# EAGLE design ENGI301_clearasteroids (EAGLE 9.6.2)
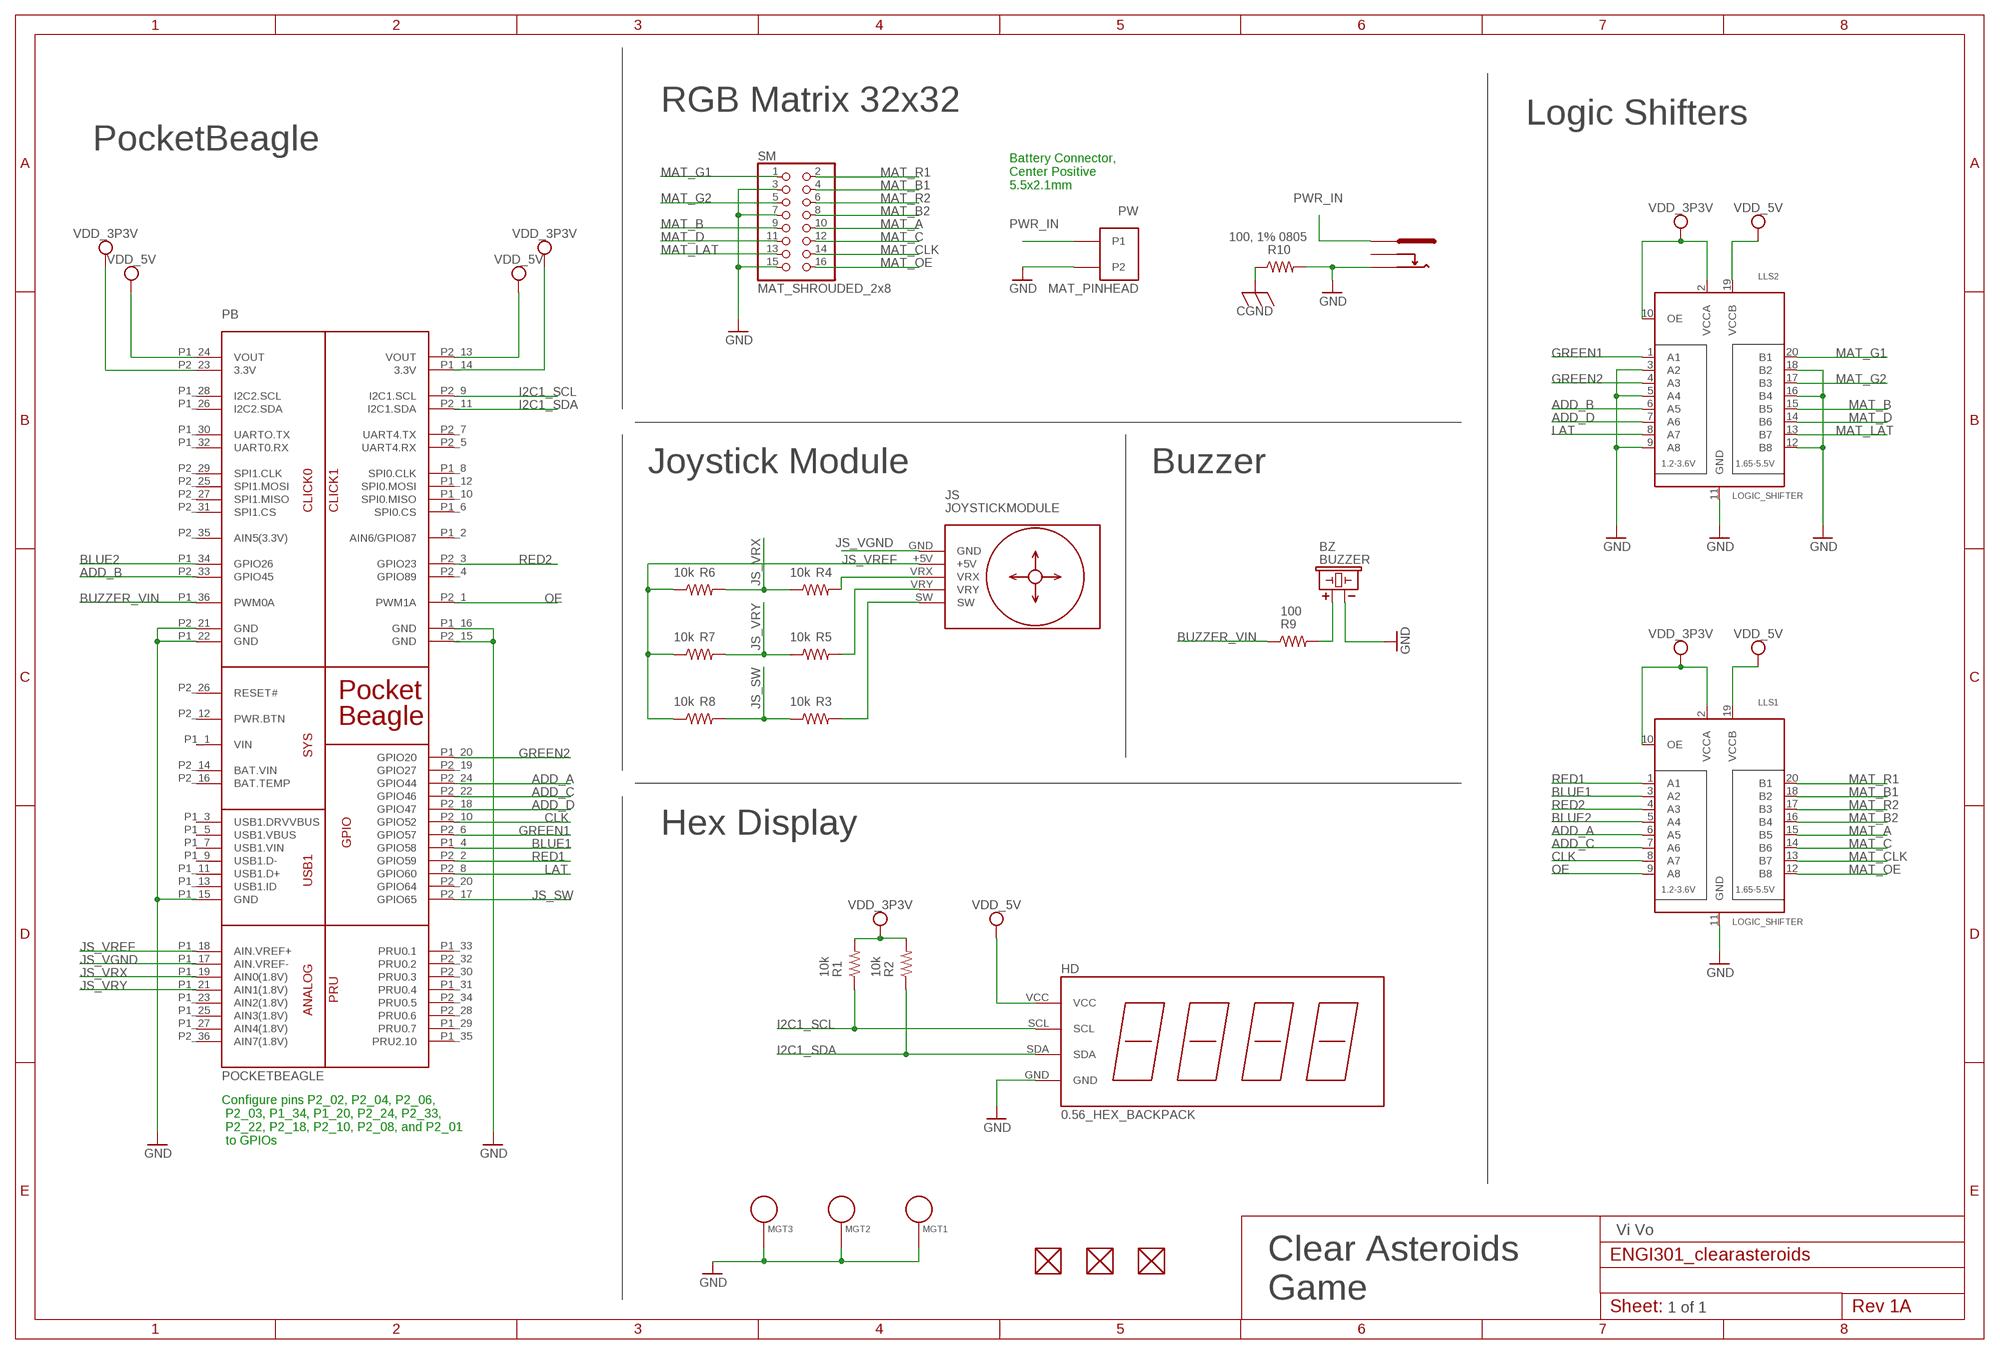
[diagram p0: schematic, sheet 1]

## Parts
BC  GHI_PJ-102B_POWER_CON  [GHI_PJ-102B_POWER_CON]
BZ  BUZZER  [BUZZER_6.5MM]
FUD1  FIDUCIAL  [FIDUCIAL_40MIL]
FUD2  FIDUCIAL  [FIDUCIAL_40MIL]
FUD3  FIDUCIAL  [FIDUCIAL_40MIL]
HD  0.56_HEX_BACKPACK  [0.56_HEX_BACKPACK]
JS  JOYSTICKMODULE  [JOYSTICK-MODULE]
LLS1  LOGIC_SHIFTER  TXB0108PWR  [TSSOP20]
LLS2  LOGIC_SHIFTER  TXB0108PWR  [TSSOP20]
MGT1  MOUNTING_HOLE  [MOUNTING_HOLE]
MGT2  MOUNTING_HOLE  [MOUNTING_HOLE]
MGT3  MOUNTING_HOLE  [MOUNTING_HOLE]
PB  POCKETBEAGLE  [POCKETBEAGLE]
PW  MAT_PINHEAD  [MSHIELD_TERMBLOCK508]
R1  10k  R_R1206  [R1206]
R2  10k  R_R1206  [R1206]
R3  10k  R_R1206  [R1206]
R4  10k  R_R1206  [R1206]
R5  10k  R_R1206  [R1206]
R6  10k  R_R1206  [R1206]
R7  10k  R_R1206  [R1206]
R8  10k  R_R1206  [R1206]
R9  100  R_R1206  [R1206]
R10  100, 1% 0805  R_R1206  [R1206]
SM  MAT_SHROUDED_2x8  MICROBUILDER_HEADER-2X8_SHROUDEDSMT  [MICROBUILDER_2X08_SHROUDEDSMT]

## Nets
ADD_A: LLS1.6(A5) PB.P2_24(GPIO44)
ADD_B: LLS2.6(A5) PB.P2_33(GPIO45)
ADD_C: LLS1.7(A6) PB.P2_22(GPIO46)
ADD_D: LLS2.7(A6) PB.P2_18(GPIO47)
BLUE1: LLS1.3(A2) PB.P1_4(GPIO58)
BLUE2: LLS1.5(A4) PB.P1_34(GPIO26)
BUZZER_VIN: PB.P1_36(PWM0A) R9.1
CGND: R10.1
CLK: LLS1.8(A7) PB.P2_10(GPIO52)
GND: BC.OUT BZ.- HD.GND LLS1.11(GND) LLS2.3(A2) LLS2.5(A4) LLS2.9(A8) LLS2.11(GND) LLS2.12(B8) LLS2.16(B4) LLS2.18(B2) MGT1.P$1 MGT2.P$1 MGT3.P$1 PB.P1_15(GND) PB.P1_16(GND) PB.P1_22(GND) PB.P2_15(GND) PB.P2_21(GND) PW.P$4(P2) R10.2 SM.3 SM.7 SM.15
GREEN1: LLS2.1(A1) PB.P2_6(GPIO57)
GREEN2: LLS2.4(A3) PB.P1_20(GPIO20)
I2C1_SCL: HD.SCL PB.P2_9(I2C1.SCL) R1.1
I2C1_SDA: HD.SDA PB.P2_11(I2C1.SDA) R2.1
JS_SW: PB.P2_17(GPIO65) R3.1 R8.2
JS_VGND: JS.GND PB.P1_17(AIN.VREF-)
JS_VREF: JS.+5V PB.P1_18(AIN.VREF+) R6.1 R7.1 R8.1
JS_VRX: PB.P1_19(AIN0(1.8V)) R4.1 R6.2
JS_VRY: PB.P1_21(AIN1(1.8V)) R5.1 R7.2
LAT: LLS2.8(A7) PB.P2_8(GPIO60)
MAT_A: LLS1.15(B5) SM.10
MAT_B: LLS2.15(B5) SM.9
MAT_B1: LLS1.18(B2) SM.4
MAT_B2: LLS1.16(B4) SM.8
MAT_C: LLS1.14(B6) SM.12
MAT_CLK: LLS1.13(B7) SM.14
MAT_D: LLS2.14(B6) SM.11
MAT_G1: LLS2.20(B1) SM.1
MAT_G2: LLS2.17(B3) SM.5
MAT_LAT: LLS2.13(B7) SM.13
MAT_OE: LLS1.12(B8) SM.16
MAT_R1: LLS1.20(B1) SM.2
MAT_R2: LLS1.17(B3) SM.6
N$46: BZ.+ R9.2
N$48: JS.VRX R4.2
N$49: JS.VRY R5.2
N$50: JS.SW R3.2
OE: LLS1.9(A8) PB.P2_1(PWM1A)
PWR_IN: BC.IN PW.P$3(P1)
RED1: LLS1.1(A1) PB.P2_2(GPIO59)
RED2: LLS1.4(A3) PB.P2_3(GPIO23)
VDD_3P3V: LLS1.2(VCCA) LLS1.10(OE) LLS2.2(VCCA) LLS2.10(OE) PB.P1_14(3.3V) PB.P2_23(3.3V) R1.2 R2.2
VDD_5V: HD.VCC LLS1.19(VCCB) LLS2.19(VCCB) PB.P1_24(VOUT) PB.P2_13(VOUT)
Unconnected: BC.OUT_CON FUD1.P$1 FUD2.P$1 FUD3.P$1 PB.P1_1(VIN) PB.P1_2(AIN6/GPIO87) PB.P1_3(USB1.DRVVBUS) PB.P1_5(USB1.VBUS) PB.P1_6(SPI0.CS) PB.P1_7(USB1.VIN) PB.P1_8(SPI0.CLK) PB.P1_9(USB1.D-) PB.P1_10(SPI0.MISO) PB.P1_11(USB1.D+) PB.P1_12(SPI0.MOSI) PB.P1_13(USB1.ID) PB.P1_23(AIN2(1.8V)) PB.P1_25(AIN3(1.8V)) PB.P1_26(I2C2.SDA) PB.P1_27(AIN4(1.8V)) PB.P1_28(I2C2.SCL) PB.P1_29(PRU0.7) PB.P1_30(UARTO.TX) PB.P1_31(PRU0.4) PB.P1_32(UART0.RX) PB.P1_33(PRU0.1) PB.P1_35(PRU2.10) PB.P2_4(GPIO89) PB.P2_5(UART4.RX) PB.P2_7(UART4.TX) PB.P2_12(PWR.BTN) PB.P2_14(BAT.VIN) PB.P2_16(BAT.TEMP) PB.P2_19(GPIO27) PB.P2_20(GPIO64) PB.P2_25(SPI1.MOSI) PB.P2_26(RESET#) PB.P2_27(SPI1.MISO) PB.P2_28(PRU0.6) PB.P2_29(SPI1.CLK) PB.P2_30(PRU0.3) PB.P2_31(SPI1.CS) PB.P2_32(PRU0.2) PB.P2_34(PRU0.5) PB.P2_35(AIN5(3.3V)) PB.P2_36(AIN7(1.8V))

## Notes on the sheet
- RGB Matrix 32x32
- Logic Shifters
- PocketBeagle
- Battery Connector, 
  Center Positive
  5.5x2.1mm
- Joystick Module | Buzzer
- Hex Display
- Configure pins P2_02, P2_04, P2_06,
   P2_03, P1_34, P1_20, P2_24, P2_33,
   P2_22, P2_18, P2_10, P2_08, and P2_01
   to GPIOs
- Vi Vo
- Clear Asteroids 
  Game
- 1 of 1

## Library data of the parts
BC = BeagleBone_Blue:GHI_PJ-102B_POWER_CON
BZ = ENGI301_ClassParts:BUZZER: CEM-1203 Buzzer
FUD1-FUD3 = ENGI301_Parts:FIDUCIAL
HD = ENGI301_ClassParts:0.56_HEX_BACKPACK: 0.56" LED HEX Backback - Adafruit HT16K33 - https://www.adafruit.com/product/878 - https://www.adafruit.com/product/879 - https://www.adafruit.com/product/880 - https://www.adafruit.com/product/881 - https://www.adafruit.com/product/1002
JS = ENGI301_AddParts:JOYSTICKMODULE: Joystick Module with Switch Button
LLS1 LLS2 = Adafruit TXB0108:TXB0108PWR: 8-Bit Bi-Directional Level Shifter 1.2V-3.6V (VCCA) to 1.65V-5.5V (VCCB) bi-directional level shifter with auto direction sensing. Max data rate - VCCA 1.8V: 20Mbps (50ns), VCCA 3.3V: 100Mbps (10ns) Digikey: 296-21527-1-ND
MGT1-MGT3 = ENGI301_ClassParts:MOUNTING_HOLE: Chassis Mounting Hole w/GND connection ability
PB = ENGI301_AddParts:POCKETBEAGLE
PW = Adafruit RGB Matrix Shield:MAT_PINHEAD
R1 R2 R9 R10 = ENGI301_ClassParts:R_: RESISTOR, American symbol
R3 = ENGI301_ClassParts:R_: RESISTOR, American symbol; R3: 10k
R4 = ENGI301_ClassParts:R_: RESISTOR, American symbol; R4: 10k
R5 = ENGI301_ClassParts:R_: RESISTOR, American symbol; R5: 10k
R6 = ENGI301_ClassParts:R_: RESISTOR, American symbol; R6: 10k
R7 = ENGI301_ClassParts:R_: RESISTOR, American symbol; R7: 10k
R8 = ENGI301_ClassParts:R_: RESISTOR, American symbol; R8: 10k
SM = Adafruit RGB Matrix Shield:MICROBUILDER_HEADER-2X8

## Board
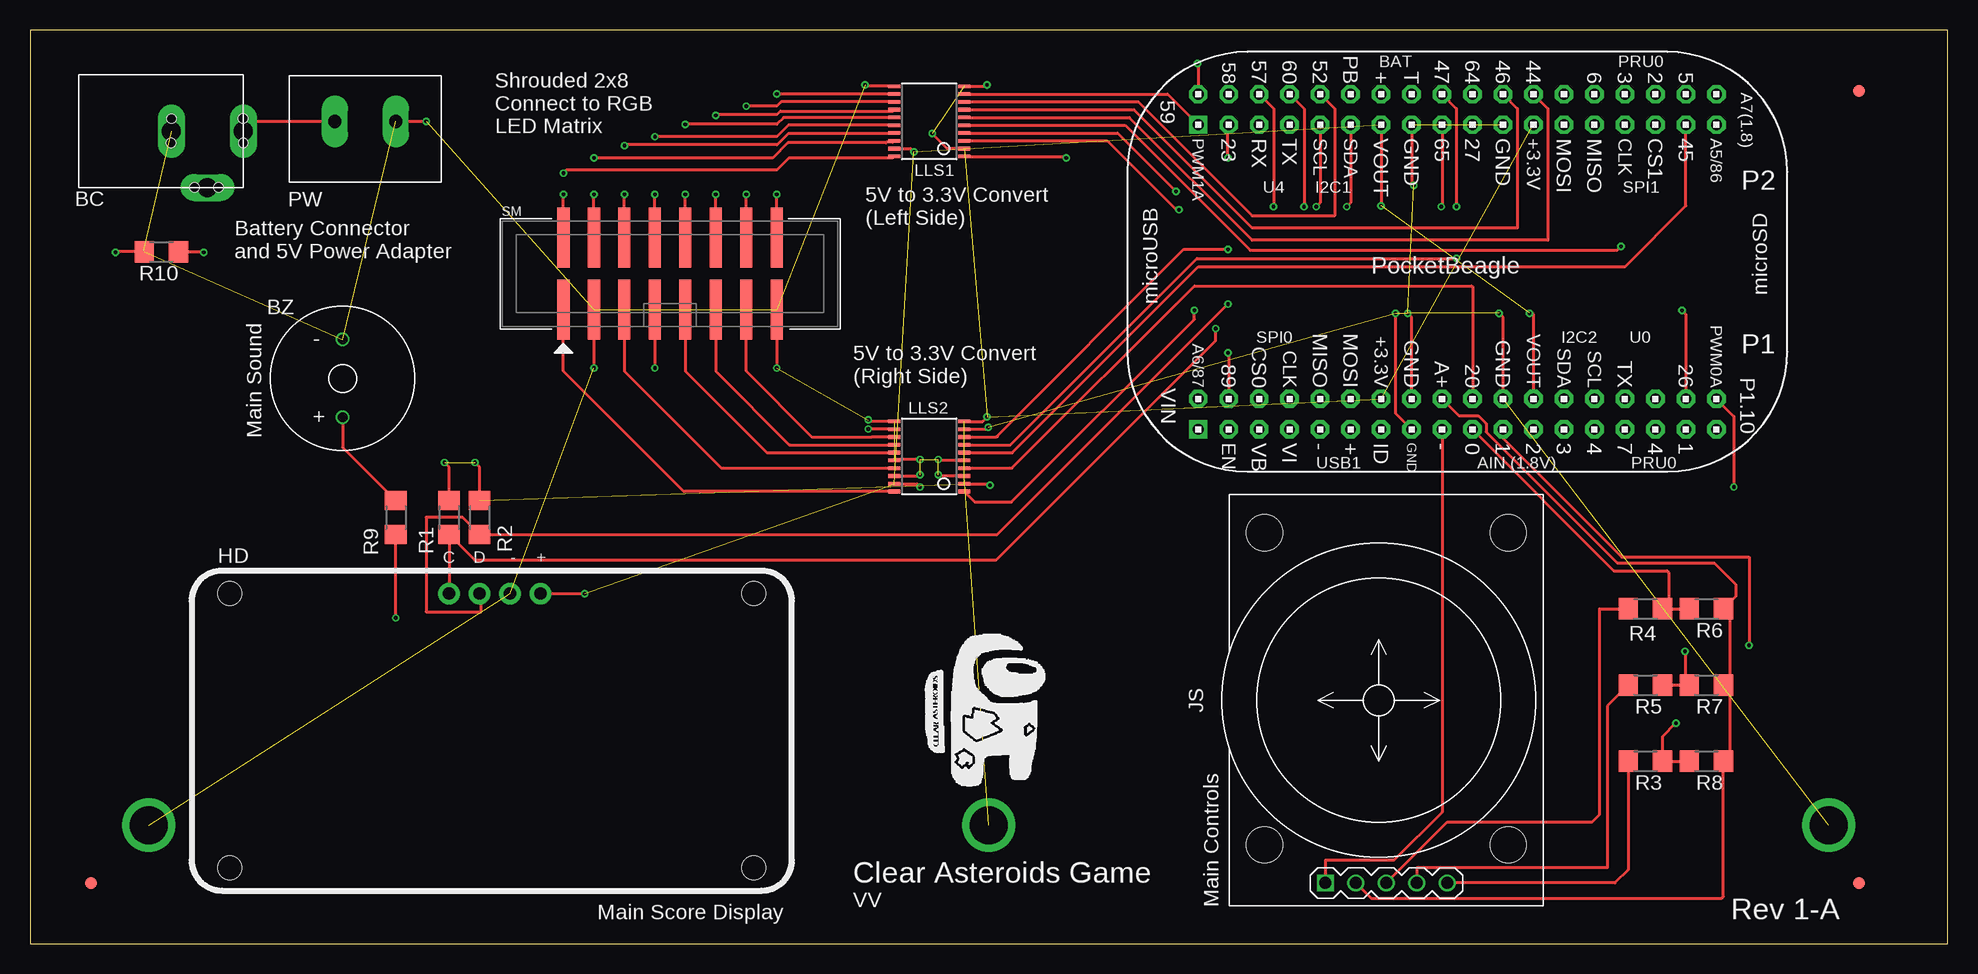
[diagram p1: board, top side]
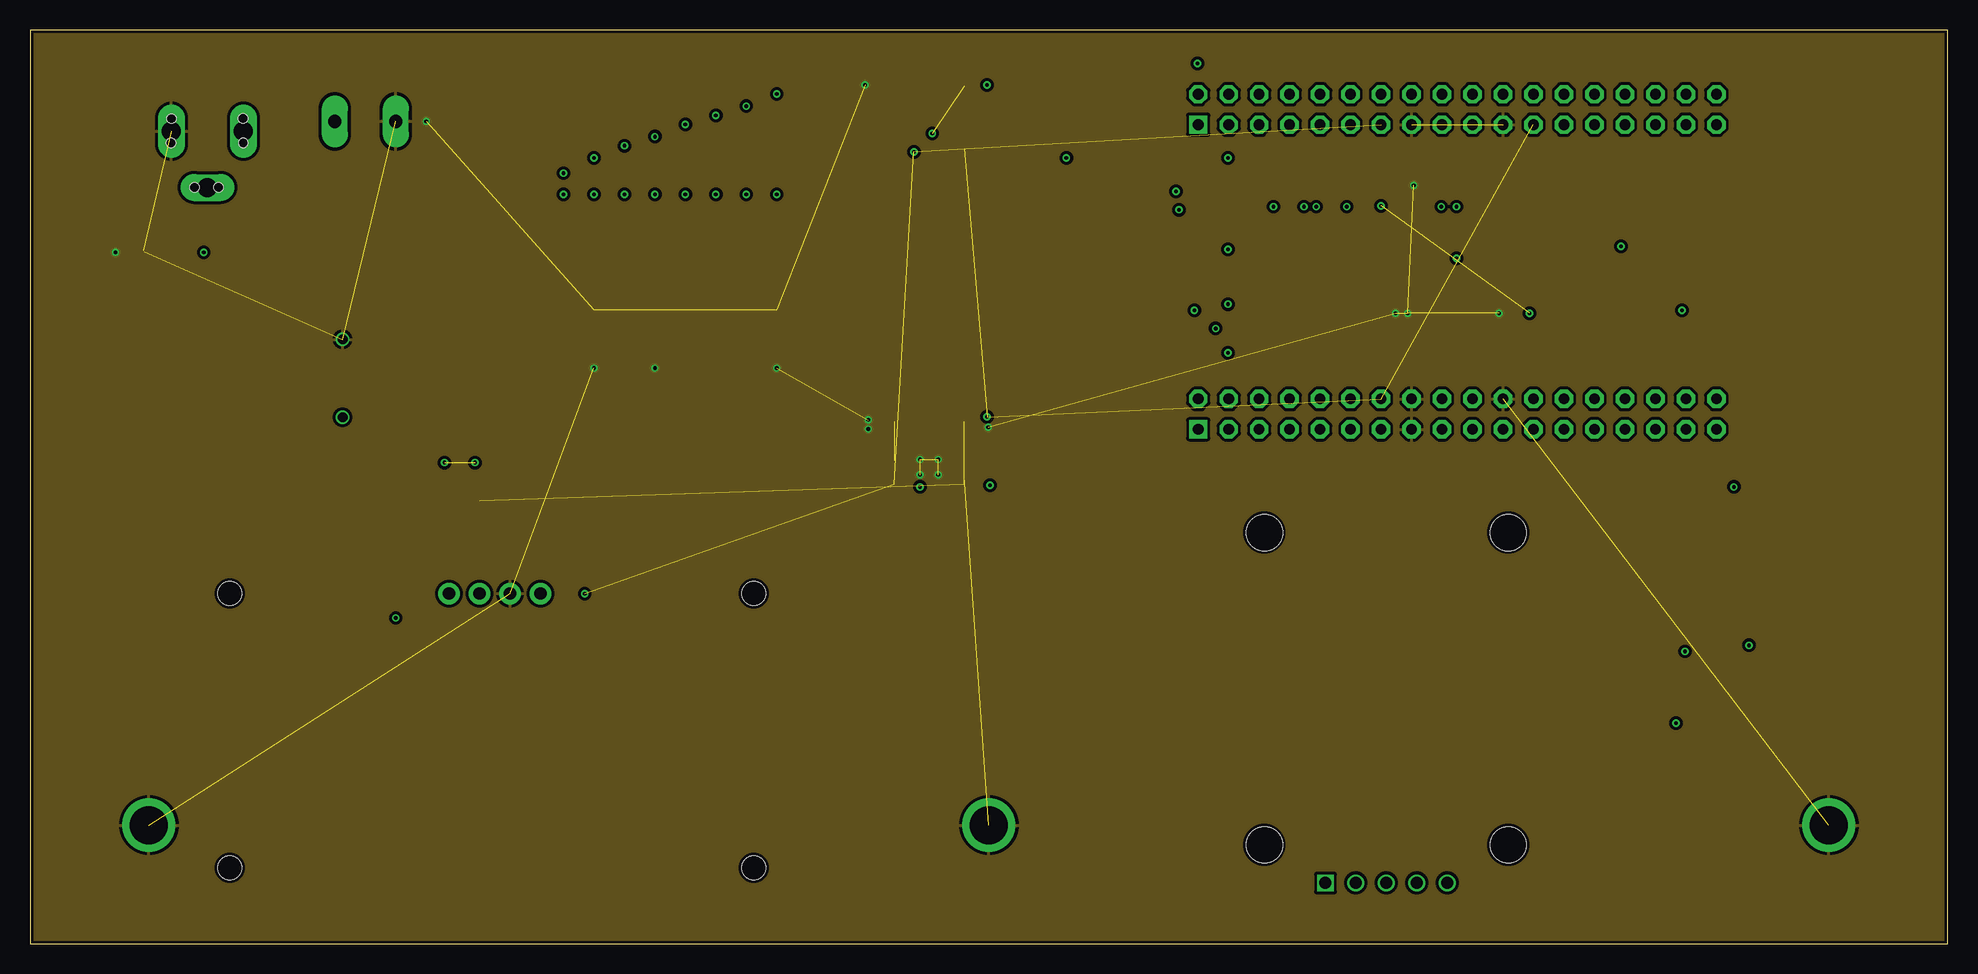
[diagram p2: board, inner layer Route2]
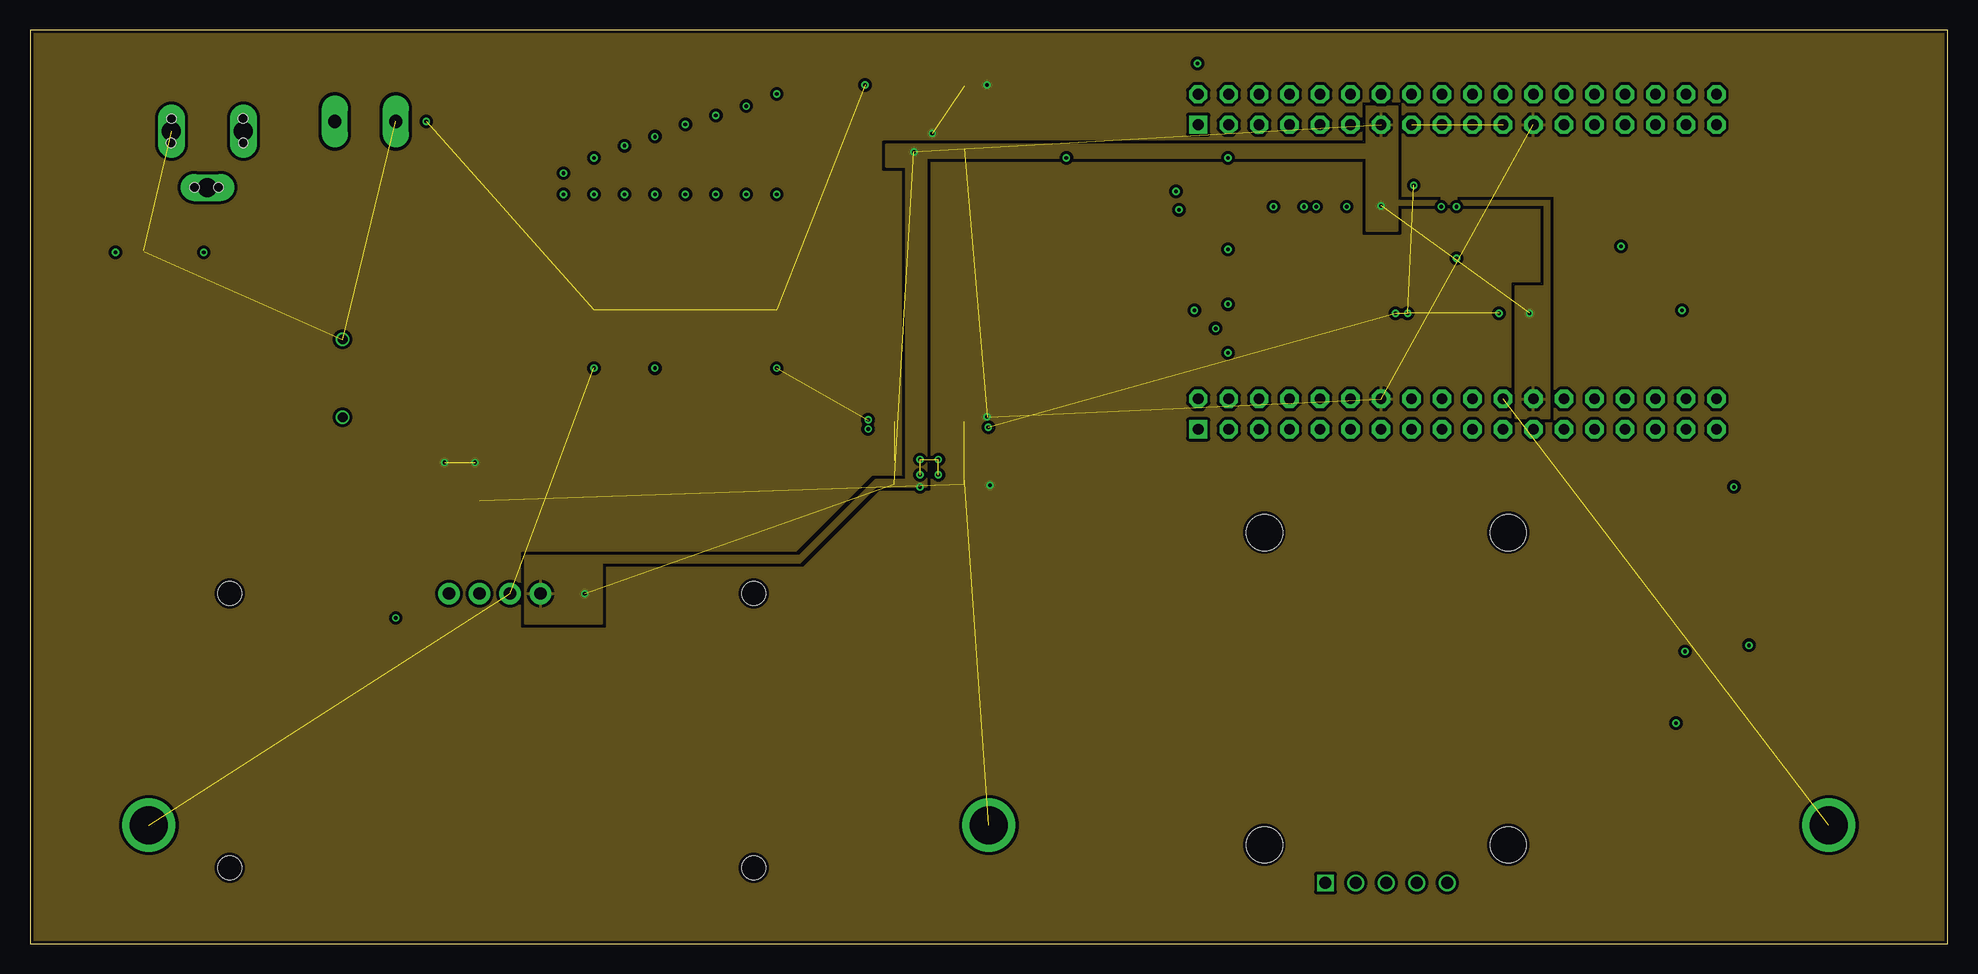
[diagram p3: board, inner layer Route15]
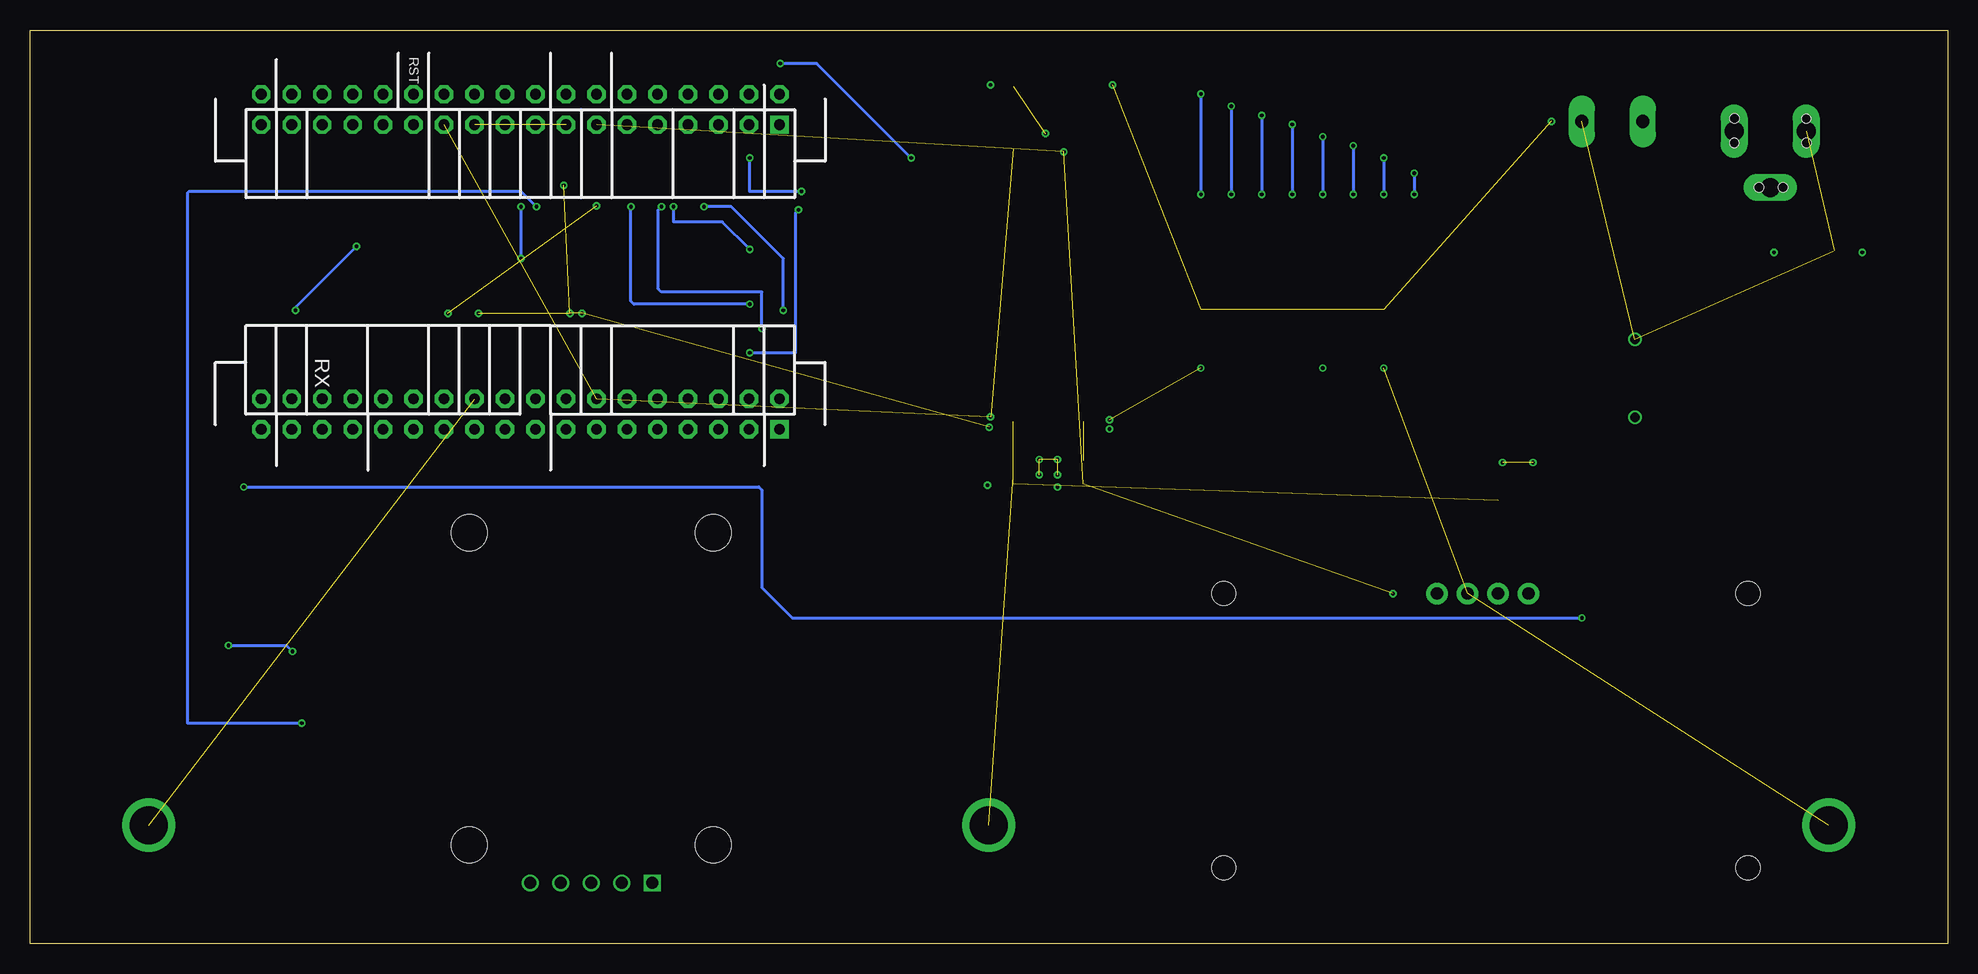
[diagram p4: board, bottom side, seen from below]

Size 159.8 x 76.2 mm. Coordinates in mm from the lower left corner, seen from the top.
Outline: 0,0 159.8,0 159.8,76.2 0,76.2 0,0
Copper layers (1*2*15*16): Top 0.035mm / dielectric 0.23mm / Route2 0.035mm / dielectric 0.93mm / Route15 0.035mm / dielectric 0.23mm / Bottom 0.035mm
Design rules "ENGI301_4lyr": minimum track width 10mil, minimum drill 12mil, track to track 10mil, track to pad 10mil, pad to pad 10mil, via to via 10mil, smd to smd 10mil, copper to edge 10mil, drill to drill 12mil, minimum pad ring 6mil, minimum via ring 6mil, stop-mask expansion 3mil, vias tented up to drill 25mil, thermal gap 10mil

### Footprints (pad centres in the part's own frame; a part is rotated, then mirrored left to right if it is on the bottom)
GHI_PJ-102B_POWER_CON = drill 1.6 long: IN -6,0; OUT 0,0; OUT_CON -3,4.7 | hole 0.762: 0,-1.041; 0.025,0.965; -5.994,0.965; -5.969,-1.067; -1.93,4.674; -3.937,4.674
BUZZER_6.5MM = drill 0.8: + 0,-3.25; - 0,3.25
FIDUCIAL_40MIL = smd 1.016 x 1.016: P$1 0,0
0.56_HEX_BACKPACK = drill 1.016 pad 1.778: GND 1.524,11.43; SCL -3.556,11.43; SDA -1.016,11.43; VCC 4.064,11.43 | hole 2: -21.844,-11.43; 21.844,-11.43; -21.844,11.43; 21.844,11.43
JOYSTICK-MODULE = drill 1: +5V -15.24,1.27; SW -15.24,-6.35; VRX -15.24,-1.27; VRY -15.24,-3.81 | drill 1 square: GND -15.24,3.81 | hole 3: -12.065,8.89; -12.065,-11.43; 13.97,-11.43; 13.97,8.89
TSSOP20 = smd 0.305 x 0.991: 1 -2.925,-2.918; 2 -2.275,-2.918; 3 -1.625,-2.918; 4 -0.975,-2.918; 5 -0.325,-2.918; 6 0.325,-2.918; 7 0.975,-2.918; 8 1.625,-2.918; 9 2.275,-2.918; 10 2.925,-2.918; 11 2.925,2.918; 12 2.275,2.918; 13 1.625,2.918; 14 0.975,2.918; 15 0.325,2.918; 16 -0.325,2.918; 17 -0.975,2.918; 18 -1.625,2.918; 19 -2.275,2.918; 20 -2.925,2.918
MOUNTING_HOLE = drill 3.175 pad 4.445: P$1 0,0
POCKETBEAGLE = drill 0.889 pad 1.524 square: P1_1 5.91,3.53; P2_1 5.91,28.93 | drill 0.889 pad 1.524 octagon: P1_2 5.91,6.07; P1_3 8.45,3.53; P1_4 8.45,6.07; P1_5 10.99,3.53; P1_6 10.99,6.07; P1_7 13.53,3.53; P1_8 13.53,6.07; P1_9 16.07,3.53; P1_10 16.07,6.07; P1_11 18.61,3.53; P1_12 18.61,6.07; P1_13 21.15,3.53; P1_14 21.15,6.07; P1_15 23.69,3.53; P1_16 23.69,6.07; P1_17 26.23,3.53; P1_18 26.23,6.07; P1_19 28.77,3.53; P1_20 28.77,6.07; P1_21 31.31,3.53; P1_22 31.31,6.07; P1_23 33.85,3.53; P1_24 33.85,6.07; P1_25 36.39,3.53; P1_26 36.39,6.07; P1_27 38.93,3.53; P1_28 38.93,6.07; P1_29 41.47,3.53; P1_30 41.47,6.07; P1_31 44.01,3.53; P1_32 44.01,6.07; P1_33 46.55,3.53; P1_34 46.55,6.07; P1_35 49.09,3.53; P1_36 49.09,6.07; P2_2 5.91,31.47; P2_3 8.45,28.93; P2_4 8.45,31.47; P2_5 10.99,28.93; P2_6 10.99,31.47; P2_7 13.53,28.93; P2_8 13.53,31.47; P2_9 16.07,28.93; P2_10 16.07,31.47; P2_11 18.61,28.93; P2_12 18.61,31.47; P2_13 21.15,28.93; P2_14 21.15,31.47; P2_15 23.69,28.93; P2_16 23.69,31.47; P2_17 26.23,28.93; P2_18 26.23,31.47; P2_19 28.77,28.93; P2_20 28.77,31.47; P2_21 31.31,28.93; P2_22 31.31,31.47; P2_23 33.85,28.93; P2_24 33.85,31.47; P2_25 36.39,28.93; P2_26 36.39,31.47; P2_27 38.93,28.93; P2_28 38.93,31.47; P2_29 41.47,28.93; P2_30 41.47,31.47; P2_31 44.01,28.93; P2_32 44.01,31.47; P2_33 46.55,28.93; P2_34 46.55,31.47; P2_35 49.09,28.93; P2_36 49.09,31.47
MSHIELD_TERMBLOCK508 = drill 1.1 pad 2.184 long: P$3 -2.54,0; P$4 2.54,0
R1206 = smd 1.6 x 1.803: 1 -1.422,0; 2 1.422,0
MICROBUILDER_2X08_SHROUDEDSMT = smd 1.02 x 5: 1 -8.89,-3; 2 -8.89,3; 3 -6.35,-3; 4 -6.35,3; 5 -3.81,-3; 6 -3.81,3; 7 -1.27,-3; 8 -1.27,3; 9 1.27,-3; 10 1.27,3; 11 3.81,-3; 12 3.81,3; 13 6.35,-3; 14 6.35,3; 15 8.89,-3; 16 8.89,3

### Placement (x,y rotation side)
BC  11.78,67.76 180 top
BZ  26.06,47.15 0 top
FUD1  5.08,5.08 0 top
FUD2  152.4,5.08 0 top
FUD3  152.4,71.12 0 top
HD  38.48,17.78 0 top
JS  111.76,20.32 90 top
LLS1  74.93,68.58 90 top
LLS2  74.93,40.64 90 top
MGT1  149.9,9.9 0 top
MGT2  9.9,9.9 0 top
MGT3  79.9,9.9 0 top
PB  91.44,39.37 0 top
PW  27.94,68.58 0 top
R1  34.92,35.56 90 top
R2  37.47,35.56 90 top
R3  134.62,15.24 180 top
R4  134.62,27.94 180 top
R5  134.62,21.59 180 top
R6  139.7,27.94 180 top
R7  139.7,21.59 180 top
R8  139.7,15.24 180 top
R9  30.48,35.56 90 top
R10  10.95,57.71 180 top
SM  53.34,55.88 0 top

### Tracks (layer width: path | path; a pad name or v marks a point on that pad's centre or on a via)
ADD_A
  Top 0.254: PB.P2_24 126.49,69.64 126.49,58.67 101.85,58.67 91.62,68.91 LLS1.6
ADD_B
  Top 0.254: PB.P2_33 137.99,61.54 132.92,56.46 97.36,56.46 81.86,40.97 LLS2.6
ADD_C
  Top 0.254: PB.P2_22 123.95,69.64 123.95,59.69 101.85,59.69 91.99,69.56 LLS1.7
ADD_D  (via drill 0.3)
  Top 0.254: PB.P2_18 118.87,69.64 v118.87,61.47 | v118.87,57.15 97.24,57.15 81.7,41.62 LLS2.7
  Bottom 0.254: v118.87,57.15 v118.87,61.47
BLUE1  (via drill 0.3)
  Top 0.254: LLS1.3 89.76,66.95 95.5,61.21 v95.76,61.21 | v99.82,49.28 99.89,49.21 PB.P1_4
  Bottom 0.254: v95.76,61.21 96.01,60.96 96.01,49.28 v99.82,49.28
BLUE2  (via drill 0.3)
  Top 0.254: LLS1.5 91.26,68.25 101.68,57.84 132.26,57.84 v132.59,58.17 | v137.67,52.83 137.99,52.51 PB.P1_34
  Bottom 0.254: v132.59,58.17 137.67,53.09 v137.67,52.83
BUZZER_VIN  (via drill 0.3)
  Top 0.254: PB.P1_36 141.99,43.98 v141.99,38.1 | v30.48,27.18 R9.1
  Bottom 0.254: v141.99,38.1 99.06,38.1 98.81,37.85 98.81,29.72 96.27,27.18 v30.48,27.18
CGND  (via drill 0.3)
  Top 0.254: R10.1 14.43,57.71 v14.48,57.66
CLK
  Top 0.254: LLS1.8 92.36,70.2 101.85,60.71 108.71,60.71 108.71,69.64 PB.P2_10
GND  (via drill 0.3)  (23 unrouted)
  Top 0.254: 9.45,57.78 R10.2 7.16,57.71 v7.11,57.66 | PB.P2_15 115.13,63.43 v115.32,63.25 | PB.P1_22 122.75,52.26 v122.43,52.58 | PB.P1_16 115.13,52.26 v114.81,52.58 | PB.P1_15 113.79,44.24 v113.79,52.58 | LLS2.9 79.7,42.91 v79.86,43.08 | LLS2.11 69.97,43.56 v69.85,43.69 | LLS2.12 69.86,42.91 v69.85,42.93 | v74.17,40.39 72.08,40.39 LLS2.16 | LLS2.18 74.07,39.02 v74.17,39.12 | LLS1.11 69.72,71.5 v69.6,71.63 | SM.3 v46.99,48.01 | SM.7 v52.07,48.01 | SM.15 v62.23,48.01 | PW.P$4 v33.02,68.58 | LLS2.5 75.76,40.31 v75.69,40.39 | LLS2.3 75.69,39.02 v75.69,39.12
  pour Route2: -2.54,78.74 162.56,78.74 162.56,-2.54 -2.54,-2.54
GREEN1  (via drill 0.3)
  Top 0.254: PB.P2_6 103.63,69.64 v103.63,61.47 | LLS2.1 78.73,36.83 81.79,36.83 97.03,52.07 v97.03,52.83
  Bottom 0.254: v97.03,52.83 97.03,57.15 101.35,61.47 v103.63,61.47
GREEN2
  Top 0.254: LLS2.4 81.83,39.66 97.03,54.86 120.14,54.86 120.21,54.8 PB.P1_20
I2C1_SCL  (via drill 0.3)
  Top 0.254: HD.SCL R1.1 37.06,32 80.52,32 98.81,50.29 v98.81,51.31 | PB.P2_9 107.51,61.79 v107.19,61.47
  Bottom 0.254: v98.81,51.31 98.81,54.36 107.19,54.36 107.44,54.61 107.44,61.21 v107.19,61.47
I2C1_SDA  (via drill 0.3)
  Top 0.254: PB.P2_11 110.05,61.79 v109.73,61.47 | v99.82,53.34 80.62,34.14 R2.1 36.04,35.56 33.02,35.56 33.02,27.69 37.59,27.69 37.59,29.08 HD.SDA
  Bottom 0.254: v99.82,53.34 109.47,53.34 109.73,53.59 v109.73,61.47
JS_SW  (via drill 0.3)
  Top 0.254: R8.2 R3.1 136.04,17.3 v137.16,18.41 | PB.P2_17 117.67,61.54 v117.6,61.47
  Bottom 0.254: v137.16,18.41 146.69,18.41 146.69,62.61 146.56,62.74 118.87,62.74 v117.6,61.47
JS_VGND
  Top 0.254: PB.P1_17 117.67,10.99 113.67,6.99 107.95,6.99 JS.GND
JS_VREF
  Top 0.254: JS.+5V 111.76,3.81 140.97,3.81 141.12,3.96 R8.1 141.63,15.75 141.63,21.08 R7.1 141.63,22.1 141.63,27.43 R6.1 142.14,28.96 142.14,29.97 140.36,31.75 132.28,31.75 121.35,42.68 121.35,43.37 120.68,44.04 119.07,44.04 PB.P1_18
JS_VRX
  Top 0.254: PB.P1_19 132,31.11 136.4,31.11 136.55,30.96 136.55,28.45 R4.1 R6.2
JS_VRY  (via drill 0.3)
  Top 0.254: R5.1 R7.2 137.92,21.95 v137.92,24.38 | PB.P1_21 122.75,42.14 132.63,32.26 143.26,32.26 v143.26,24.89
  Bottom 0.254: v143.26,24.89 138.43,24.89 v137.92,24.38
LAT  (via drill 0.3)
  Top 0.254: PB.P2_8 106.17,69.64 v106.17,61.47 | LLS2.8 80.52,42.27 | 80.62,42.27 80.52,42.27 | 80.52,42.27 96.17,57.91 v99.82,57.91
  Bottom 0.254: v99.82,57.91 102.11,60.2 106.17,60.2 v106.17,61.47
MAT_A  (via drill 0.3)
  Top 0.254: SM.10 v54.61,62.48 | LLS1.15 62.81,68.91 62.23,68.33 v54.61,68.33
  Bottom 0.254: v54.61,68.33 v54.61,62.48
MAT_B
  Top 0.254: SM.9 54.61,47.75 61.4,40.97 LLS2.15
MAT_B1  (via drill 0.3)
  Top 0.254: SM.4 v46.99,62.48 | LLS1.18 71.9,66.84 71.36,66.84 71.32,66.8 63.16,66.8 61.89,65.53 v46.99,65.53
  Bottom 0.254: v46.99,65.53 v46.99,62.48
MAT_B2  (via drill 0.3)
  Top 0.254: SM.8 v52.07,62.48 | LLS1.16 63.17,68.25 62.23,67.31 v52.07,67.31
  Bottom 0.254: v52.07,67.31 v52.07,62.48
MAT_C  (via drill 0.3)
  Top 0.254: SM.12 v57.15,62.48 | LLS1.14 71.9,69.44 62.54,69.44 62.26,69.16 57.23,69.16 v57.15,69.09
  Bottom 0.254: v57.15,69.09 v57.15,62.48
MAT_CLK  (via drill 0.3)
  Top 0.254: SM.14 v59.69,62.48 | LLS1.13 62.59,70.2 62.23,69.85 v59.69,69.85
  Bottom 0.254: v59.69,69.85 v59.69,62.48
MAT_D
  Top 0.254: SM.11 57.15,47.75 63.29,41.62 LLS2.14
MAT_G1
  Top 0.254: LLS2.20 54.49,37.72 44.45,47.75 SM.1
MAT_G2
  Top 0.254: SM.5 49.53,47.75 57.62,39.66 LLS2.17
MAT_LAT
  Top 0.254: LLS2.13 70.16,42.27 70.13,42.24 65.2,42.24 59.69,47.75 SM.13
MAT_OE  (via drill 0.3)
  Top 0.254: SM.16 v62.23,62.48 | LLS1.12 62.24,70.86 v62.23,70.87
  Bottom 0.254: v62.23,70.87 v62.23,62.48
MAT_R1  (via drill 0.3)
  Top 0.254: SM.2 v44.45,62.48 | v44.45,64.26 44.7,64.52 62.23,64.52 63.25,65.53 71.89,65.53 LLS1.20
  Bottom 0.254: v44.45,64.26 v44.45,62.48
MAT_R2  (via drill 0.3)
  Top 0.254: SM.6 v49.53,62.48 | LLS1.17 71.97,67.56 63.2,67.56 62.26,66.62 49.61,66.62 v49.53,66.55
  Bottom 0.254: v49.53,66.55 v49.53,62.48
N$46
  Top 0.254: BZ.+ 26.06,41.4 R9.2
N$48
  Top 0.254: JS.VRX 118.11,10.16 130.18,10.16 130.81,10.79 130.81,27.94 R4.2
N$49
  Top 0.254: R5.2 131.44,19.84 131.44,6.35 115.57,6.35 JS.VRY
N$50
  Top 0.254: R3.2 133.2,6.2 132.08,5.08 JS.SW
OE
  Top 0.254: LLS1.9 94.8,70.86 PB.P2_1
PWR_IN
  Top 0.254: BC.IN 18.6,68.58 PW.P$3
RED1  (via drill 0.3)
  Top 0.254: LLS1.1 86.24,65.66 v86.36,65.53 | v97.28,73.41 97.35,73.34 PB.P2_2
  Bottom 0.254: v86.36,65.53 94.23,73.41 v97.28,73.41
RED2  (via drill 0.3)
  Top 0.254: LLS1.4 90.64,67.61 v95.5,62.74 | v99.82,65.53 99.82,68.23 PB.P2_3
  Bottom 0.254: v95.5,62.74 99.82,62.74 v99.82,65.53
VDD_3P3V  (via drill 0.3)  (7 unrouted)
  Top 0.254: R1.2 34.92,39.75 v34.54,40.13 | R2.2 37.47,39.75 v37.08,40.13 | LLS2.10 79.38,43.56 v79.76,43.94 | LLS2.2 79.9,38.37 v80.01,38.25 | LLS1.10 79.63,71.5 v79.76,71.63 | 77.84,66.29 LLS1.2 76.44,66.31 v75.18,67.56
  pour Route15 (rank 6): -5.08,81.28 -5.08,-5.08 165.1,-5.08 165.1,81.28
VDD_5V  (via drill 0.3)  (4 unrouted)
  Top 0.254: PB.P2_13 v112.59,61.54 | PB.P1_24 125.29,52.51 125.22,52.58 v124.97,52.58 | HD.VCC v46.23,29.21 | LLS2.19 73.9,38.37 v74.17,38.1 | LLS1.19 73.39,66.31 v73.66,66.04
  pour Route15: 41.27,26.67 41.27,32.38 64.14,32.38 70.48,38.73 73.03,38.73 73.03,64.77 71.37,64.77 71.37,66.67 111.38,66.67 111.38,69.85 113.92,69.85 113.92,61.98 126.62,61.98 126.62,43.81 123.83,43.81 123.83,54.86 126.24,54.86 126.24,61.59 113.92,61.59 113.92,59.44 111.38,59.44 111.38,65.53 74.68,65.53 74.68,38.1 70.48,38.1 64.14,31.75 47.62,31.75 47.62,26.67

### Text on the board
tPlace: Shrouded 2x8 / Connect to RGB / LED Matrix | 5V to 3.3V Convert / (Left Side) | Battery Connector / and 5V Power Adapter | 5V to 3.3V Convert / (Right Side) | Main Sound | Clear Asteroids Game | VV | Main Controls | Main Score Display | Rev 1-A